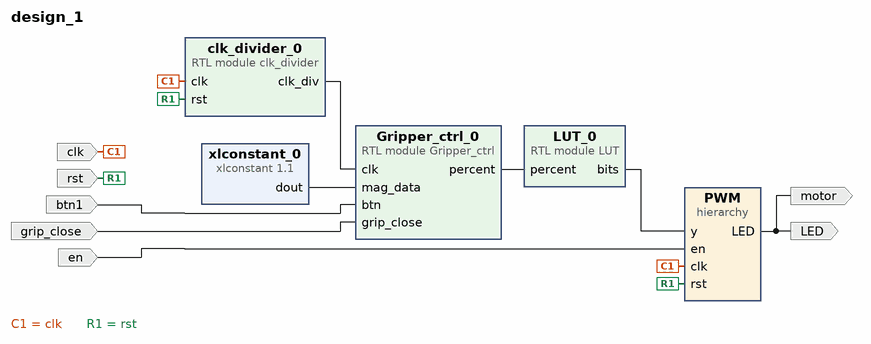
[diagram p0: block diagram of the top level]
# Vivado block design design_1, xc7z020clg400-1, Vivado 2021.1
create_bd_design design_1

create_bd_port -dir I -type clk clk
create_bd_port -dir I en
create_bd_port -dir I -type rst rst
create_bd_port -dir O LED
create_bd_port -dir O motor
create_bd_port -dir I btn1
create_bd_port -dir I grip_close

create_bd_cell -type hier PWM
create_bd_cell -type module -reference LUT LUT_0
create_bd_cell -type module -reference clk_divider clk_divider_0
create_bd_cell -type ip -vlnv xilinx.com:ip:xlconstant:1.1 xlconstant_0
set_property -dict {CONFIG.CONST_VAL 0 CONFIG.CONST_WIDTH 16} [get_bd_cells xlconstant_0]
create_bd_cell -type module -reference Gripper_ctrl Gripper_ctrl_0

# ---- hierarchy /PWM ----
current_bd_instance /PWM
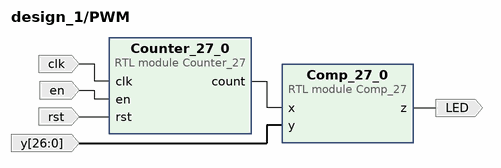
[diagram p1: block diagram inside /PWM]
create_bd_pin -dir I en
create_bd_pin -dir I -type clk clk
create_bd_pin -dir I -type rst rst
create_bd_pin -dir I -from 26 -to 0 y
create_bd_pin -dir O LED

create_bd_cell -type module -reference Comp_27 Comp_27_0
create_bd_cell -type module -reference Counter_27 Counter_27_0

# ---- connections ----

current_bd_instance /PWM
connect_bd_net [get_bd_pins Comp_27_0/z] [get_bd_pins LED]
connect_bd_net [get_bd_pins Counter_27_0/count] [get_bd_pins Comp_27_0/x]
connect_bd_net -net clk_0_1 [get_bd_pins clk] [get_bd_pins Counter_27_0/clk]
connect_bd_net -net en_0_1 [get_bd_pins en] [get_bd_pins Counter_27_0/en]
connect_bd_net -net rst_0_1 [get_bd_pins rst] [get_bd_pins Counter_27_0/rst]
connect_bd_net -net xlconstant_0_dout [get_bd_pins y] [get_bd_pins Comp_27_0/y]

current_bd_instance /
connect_bd_net -net Comp_27_0_z [get_bd_pins PWM/LED] [get_bd_ports LED] [get_bd_ports motor]
connect_bd_net [get_bd_pins Gripper_ctrl_0/percent] [get_bd_pins LUT_0/percent]
connect_bd_net [get_bd_pins LUT_0/bits] [get_bd_pins PWM/y]
connect_bd_net -net btn_0_1 [get_bd_ports btn1] [get_bd_pins Gripper_ctrl_0/btn]
connect_bd_net [get_bd_ports clk] [get_bd_pins PWM/clk] [get_bd_pins clk_divider_0/clk]
connect_bd_net [get_bd_pins clk_divider_0/clk_div] [get_bd_pins Gripper_ctrl_0/clk]
connect_bd_net -net en_0_1 [get_bd_ports en] [get_bd_pins PWM/en]
connect_bd_net -net grip_close_0_1 [get_bd_ports grip_close] [get_bd_pins Gripper_ctrl_0/grip_close]
connect_bd_net -net rst_0_1 [get_bd_ports rst] [get_bd_pins PWM/rst] [get_bd_pins clk_divider_0/rst]
connect_bd_net [get_bd_pins xlconstant_0/dout] [get_bd_pins Gripper_ctrl_0/mag_data]

validate_bd_design
save_bd_design
